# Altium schematic sheet USB-C_Adapter.SchDoc
size A4
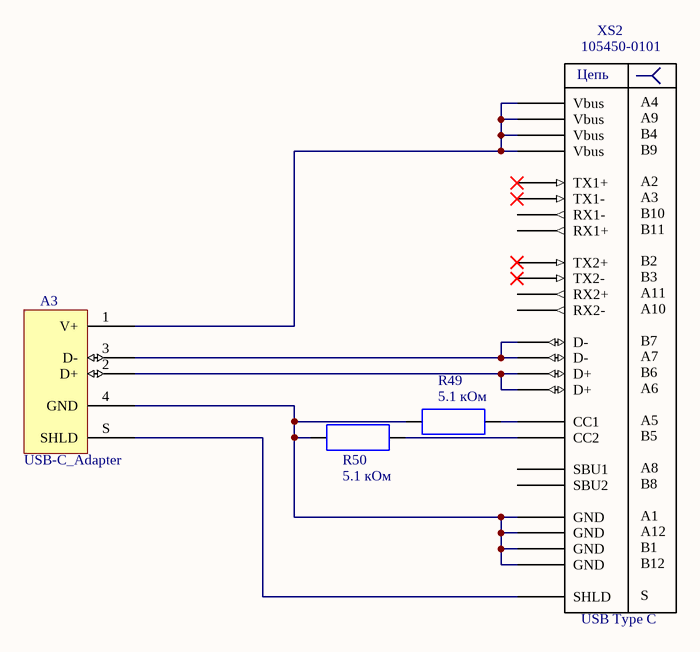
[diagram p0: USB-C_Adapter.SchDoc]

## Parts
A3  USB-C_Adapter  [Usb-C_Adapter]  (no BOM)
R49  value 5.1 кОм  [RES_0603-1608]  (hidden comment: Res)
R50  value 5.1 кОм  [RES_0603-1608]  (hidden comment: Res)
XS2  USB Type C  [105450-0101]

## Nets
NetA3_1: A3.1(V+) XS2.A4(Vbus) XS2.A9(Vbus) XS2.B4(Vbus) XS2.B9(Vbus)
NetA3_2: A3.2(D+) XS2.A6(D+) XS2.B6(D+)
NetA3_3: A3.3(D-) XS2.A7(D-) XS2.B7(D-)
NetA3_4: A3.4(GND) R49.2 R50.2 XS2.A1(GND) XS2.A12(GND) XS2.B1(GND) XS2.B12(GND)
NetA3_S: A3.S(SHLD) XS2.S(SHLD)
NetR49_1: R49.1 XS2.A5(CC1)
NetR50_1: R50.1 XS2.B5(CC2)

Not connected (* = marked no-connect by the designer): XS2 A2(TX1+)* A3(TX1-)* A8(SBU1) A10(RX2-) A11(RX2+) B2(TX2+)* B3(TX2-)* B8(SBU2) B10(RX1-) B11(RX1+)

## Notes on the sheet
- (in symbol USB-C_Generic) Цепь

## Library data of the parts
R49 R50 = Res: Резистор постоянный; Power: 0.125 W; Tolerance: 5%; BomGroup: Резисторы; BomTitle: Резистор SMD; Case: 0603
XS2 = USB-C_Generic: BomGroup: Соединители; BomTitle: Гнездо USB тип C; Type: 105450-0101